# Altium schematic sheet [6]-H3_MAIN.SchDoc
size A4
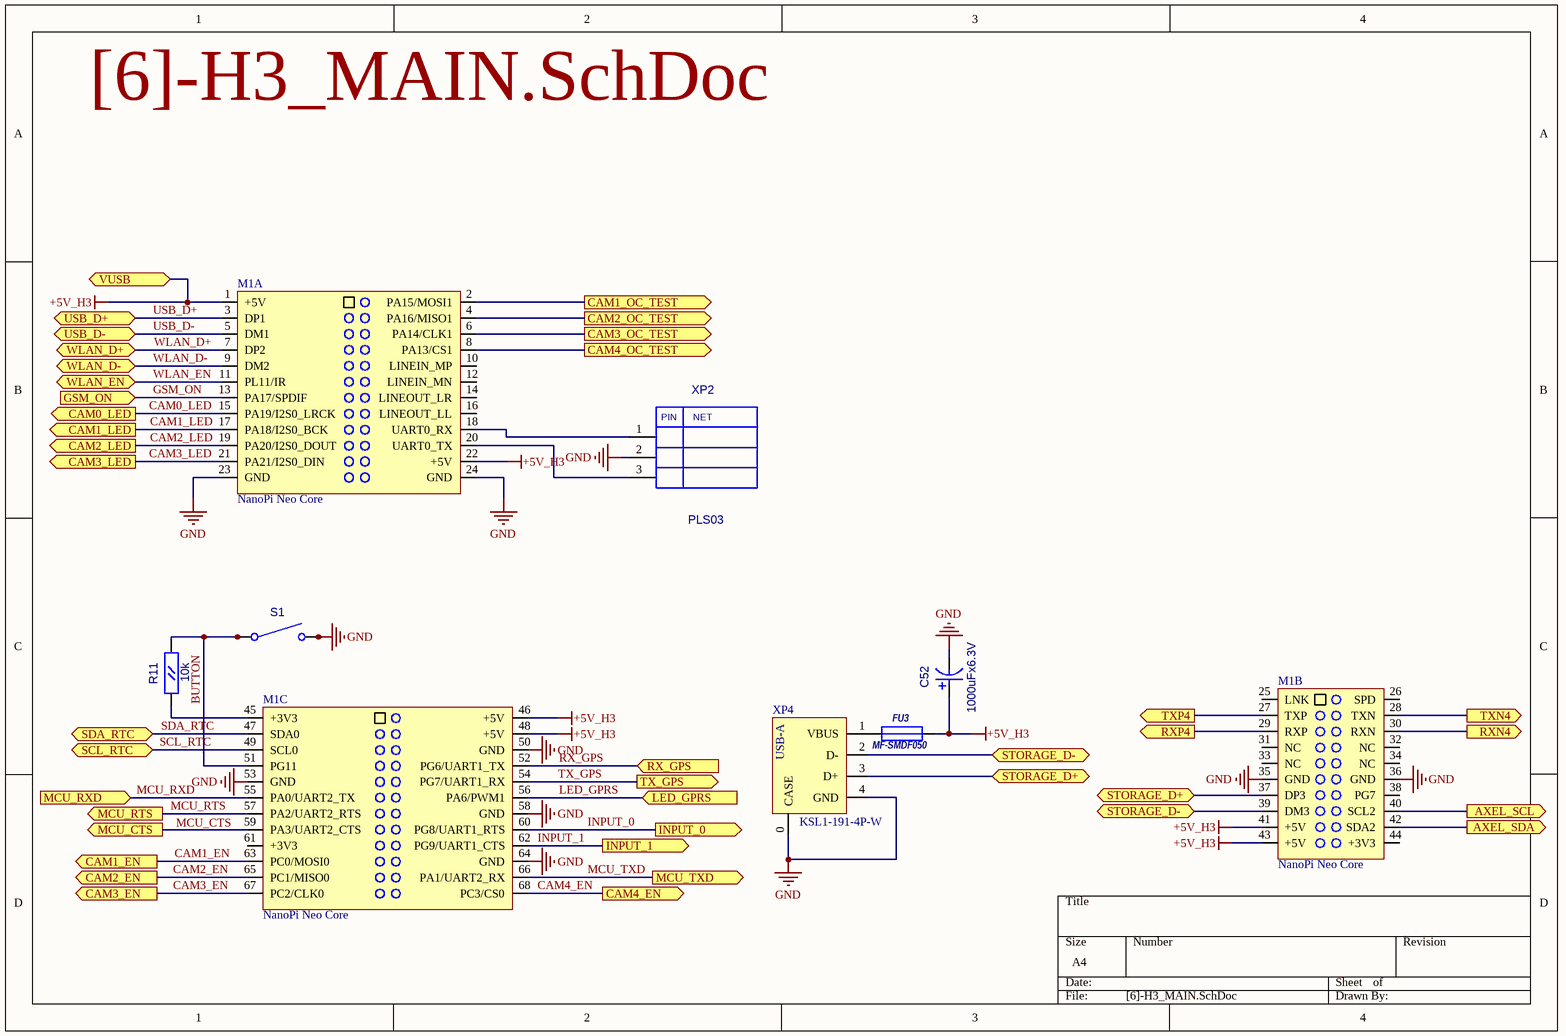
[diagram p0: [6]-H3_MAIN.SchDoc]

## Parts
C52  value 1000uFx6.3V  [CC8X3.5]  (hidden comment: CAP0.35)
FU3  MF-SMDF050  [MF-SMDF]
M1  NanoPi Neo Core  [NanoPiNeo_CORE]  (parts A,B,C of 3)
R11  10k  [RC0603]
S1  DTSM-61N  [DTSM-61N]  (value not drawn)
XP2  PLS03  [PLS-03]
XP4  KSL1-191-4P-W  [USB_A_REAR]

## Ports
AXEL_SCL (out), AXEL_SDA (out), CAM0_LED (out), CAM1_EN (out), CAM1_LED (out), CAM1_OC_TEST (out), CAM2_EN (out), CAM2_LED (out), CAM2_OC_TEST (out), CAM3_EN (out), CAM3_LED (out), CAM3_OC_TEST (out), CAM4_EN (out), CAM4_OC_TEST (out), GSM_ON (in), INPUT_0 (out), INPUT_1 (out), LED_GPRS (in), MCU_CTS (out), MCU_RTS (out), MCU_RXD (in), MCU_TXD (out), RX_GPS (in), RXN4 (out), RXP4 (out), SCL_RTC (bidir), SDA_RTC (bidir), STORAGE_D+ (bidir), STORAGE_D- (bidir), TX_GPS (out), TXN4 (out), TXP4 (out), USB_D+ (bidir), USB_D- (bidir), VUSB (bidir), WLAN_D+ (bidir), WLAN_D- (bidir), WLAN_EN (bidir)

## Nets
+5V_H3: C52.1 FU3.2 M1.1(+5V) M1.22(+5V) M1.41(+5V) M1.43(+5V) M1.46(+5V) M1.48(+5V) ; port VUSB
GND: C52.2 M1.23(GND) M1.24(GND) M1.35(GND) M1.36(GND) M1.50(GND) M1.53(GND) M1.58(GND) M1.64(GND) S1.3(C2) S1.4 XP2.2 XP4.0(CASE) XP4.4(GND)
AXEL_SCL: M1.40(SCL2) ; port AXEL_SCL
AXEL_SDA: M1.42(SDA2) ; port AXEL_SDA
BUTTON: M1.51(PG11) R11.2(B) S1.1(C1) S1.2
CAM0_LED: M1.15(PA19/I2S0_LRCK) ; port CAM0_LED
CAM1_EN: M1.63(PC0/MOSI0) ; port CAM1_EN
CAM1_LED: M1.17(PA18/I2S0_BCK) ; port CAM1_LED
CAM1_OC_TEST: M1.2(PA15/MOSI1) ; port CAM1_OC_TEST
CAM2_EN: M1.65(PC1/MISO0) ; port CAM2_EN
CAM2_LED: M1.19(PA20/I2S0_DOUT) ; port CAM2_LED
CAM2_OC_TEST: M1.4(PA16/MISO1) ; port CAM2_OC_TEST
CAM3_EN: M1.67(PC2/CLK0) ; port CAM3_EN
CAM3_LED: M1.21(PA21/I2S0_DIN) ; port CAM3_LED
CAM3_OC_TEST: M1.6(PA14/CLK1) ; port CAM3_OC_TEST
CAM4_EN: M1.68(PC3/CS0) ; port CAM4_EN
CAM4_OC_TEST: M1.8(PA13/CS1) ; port CAM4_OC_TEST
GSM_ON: M1.13(PA17/SPDIF) ; port GSM_ON
INPUT_0: M1.60(PG8/UART1_RTS) ; port INPUT_0
INPUT_1: M1.62(PG9/UART1_CTS) ; port INPUT_1
LED_GPRS: M1.56(PA6/PWM1) ; port LED_GPRS
MCU_CTS: M1.59(PA3/UART2_CTS) ; port MCU_CTS
MCU_RTS: M1.57(PA2/UART2_RTS) ; port MCU_RTS
MCU_RXD: M1.55(PA0/UART2_TX) ; port MCU_RXD
MCU_TXD: M1.66(PA1/UART2_RX) ; port MCU_TXD
RX_GPS: M1.52(PG6/UART1_TX) ; port RX_GPS
RXN4: M1.30(RXN) ; port RXN4
RXP4: M1.29(RXP) ; port RXP4
SCL_RTC: M1.49(SCL0) ; port SCL_RTC
SDA_RTC: M1.47(SDA0) ; port SDA_RTC
STORAGE_D+: M1.37(DP3) XP4.3(D+) ; port STORAGE_D+
STORAGE_D-: M1.39(DM3) XP4.2(D-) ; port STORAGE_D-
TX_GPS: M1.54(PG7/UART1_RX) ; port TX_GPS
TXN4: M1.28(TXN) ; port TXN4
TXP4: M1.27(TXP) ; port TXP4
USB_D+: M1.3(DP1) ; port USB_D+
USB_D-: M1.5(DM1) ; port USB_D-
WLAN_D+: M1.7(DP2) ; port WLAN_D+
WLAN_D-: M1.9(DM2) ; port WLAN_D-
WLAN_EN: M1.11(PL11/IR) ; port WLAN_EN
NetFU3_1: FU3.1 XP4.1(VBUS)
NetM1_18: M1.18(UART0_RX) XP2.1
NetM1_20: M1.20(UART0_TX) XP2.3
NetM1_45: M1.45(+3V3) R11.1(A)

Not connected (* = marked no-connect by the designer): M1 10(LINEIN_MP) 12(LINEIN_MN) 14(LINEOUT_LR) 16(LINEOUT_LL) 25(LNK) 26(SPD) 31(NC) 32(NC) 33(NC) 34(NC) 38(PG7) 44(+3V3) 61(+3V3)

## Notes on the sheet
- Labels drawn without touching a wire or pin: MCU_CTS
- (in symbol PLS03) PIN; NET
- (in symbol USB_A_REAR) USB-A

## Library data of the parts
FU3 = MF-SMDF: Value: *
M1 = NanoPi Neo Core: Nano Pi Neo Core Allwinner H3 based embedded module; Value: NanoPi Neo Core
R11 = RC0603: Value: 10k
S1 = DTSM-61N: Switch, Single Pole, Single Throw, Normally Open; Value: {Value}
XP4 = USB_A_REAR: USB A rear side connector; Value: KSL1-191-4P-W
XP2 = PLS03: Value: *